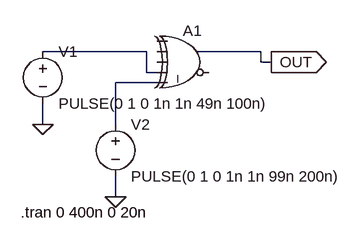
[diagram p0: schematic XOR.asc]
XOR.asc, the LTspice schematic file:
Version 4
SHEET 1 880 680
WIRE 160 96 0 96
WIRE 336 96 240 96
WIRE 336 112 336 96
WIRE 352 112 336 112
WIRE 160 128 160 96
WIRE 176 128 160 128
WIRE 176 144 112 144
WIRE 0 208 0 176
WIRE 112 208 112 144
WIRE 112 320 112 288
FLAG 0 208 0
FLAG 112 320 0
FLAG 352 112 OUT
IOPIN 352 112 Out
SYMBOL Digital\\xor 224 48 R0
SYMATTR InstName A1
SYMBOL voltage 0 80 R0
WINDOW 123 0 0 Left 0
WINDOW 39 0 0 Left 0
SYMATTR InstName V1
SYMATTR Value PULSE(0 1 0 1n 1n 49n 100n)
SYMBOL voltage 112 192 R0
WINDOW 123 0 0 Left 0
WINDOW 39 0 0 Left 0
SYMATTR InstName V2
SYMATTR Value PULSE(0 1 0 1n 1n 99n 200n)
TEXT -34 344 Left 2 !.tran 0 400n 0 20n

The netlist it stands for:
* XOR.asc
A1 0 0 0 N001 N002 0 OUT 0 XOR
V1 N001 0 PULSE(0 1 0 1n 1n 49n 100n)
V2 N002 0 PULSE(0 1 0 1n 1n 99n 200n)
.tran 0 400n 0 20n
.backanno
.end